# Altium project moodlight.PrjPcb
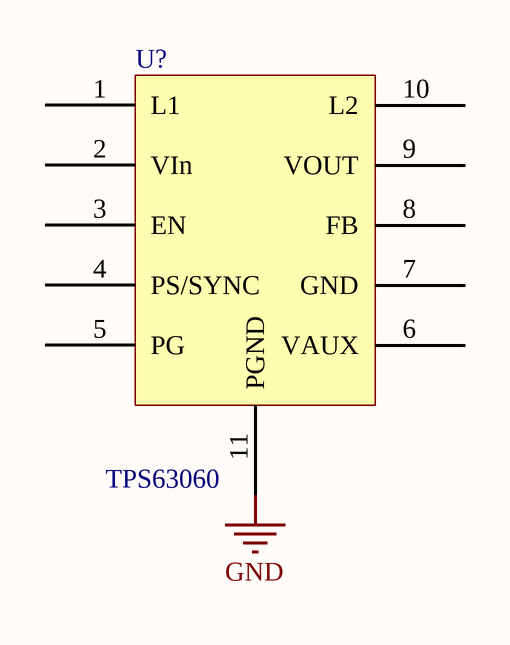
[diagram p0: voeding.SchDoc]
5 sheets, 1 parts. Net scope: global (net labels, ports and power ports of the same name join across sheets).
Board file: moodlighpcb.PcbDoc
Sheets:
  top.SchDoc
  voeding.SchDoc
  controller.SchDoc
  conectivety.SchDoc
  Leds.SchDoc

## Sheet top.SchDoc
size A

## Sheet voeding.SchDoc
size A

### Parts
U?  TPS63060  [TPS63060]

### Nets
GND: U?.11(PGND)

Not connected (* = marked no-connect by the designer): U? 1(L1) 2(VIn) 3(EN) 4(PS/SYNC) 5(PG) 6(VAUX) 7(GND) 8(FB) 9(VOUT) 10(L2)

## Sheet controller.SchDoc
size A

## Sheet conectivety.SchDoc
size A

## Sheet Leds.SchDoc
size A